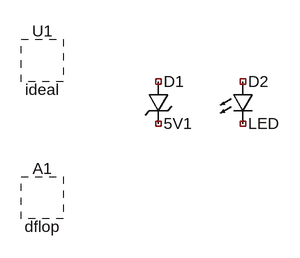
[diagram p0: schematic inspectors.asc]
inspectors.asc, the LTspice schematic file:
Version 4
SHEET 1 880 680
SYMBOL opamp2 224 176 R0
SYMATTR InstName U1
SYMATTR Value ideal
SYMBOL zener 384 208 R0
SYMATTR InstName D1
SYMATTR Value 5V1
SYMBOL led 512 208 R0
SYMATTR InstName D2
SYMATTR Value LED
SYMBOL dflop 224 384 R0
SYMATTR InstName A1

The netlist it stands for:
* inspectors.asc
* U1: ideal (symbol opamp2 not available, pin order unknown); nets seen at it: 
D1 NC_01 NC_02 5V1
D2 NC_03 NC_04 LED
* A1: dflop (symbol dflop not available, pin order unknown); nets seen at it: 
.model D D
.lib standard.dio
.backanno
.end